# Altium schematic sheet Power Monitor.SchDoc
size A; SheetNumber: 5; SheetTotal: 7
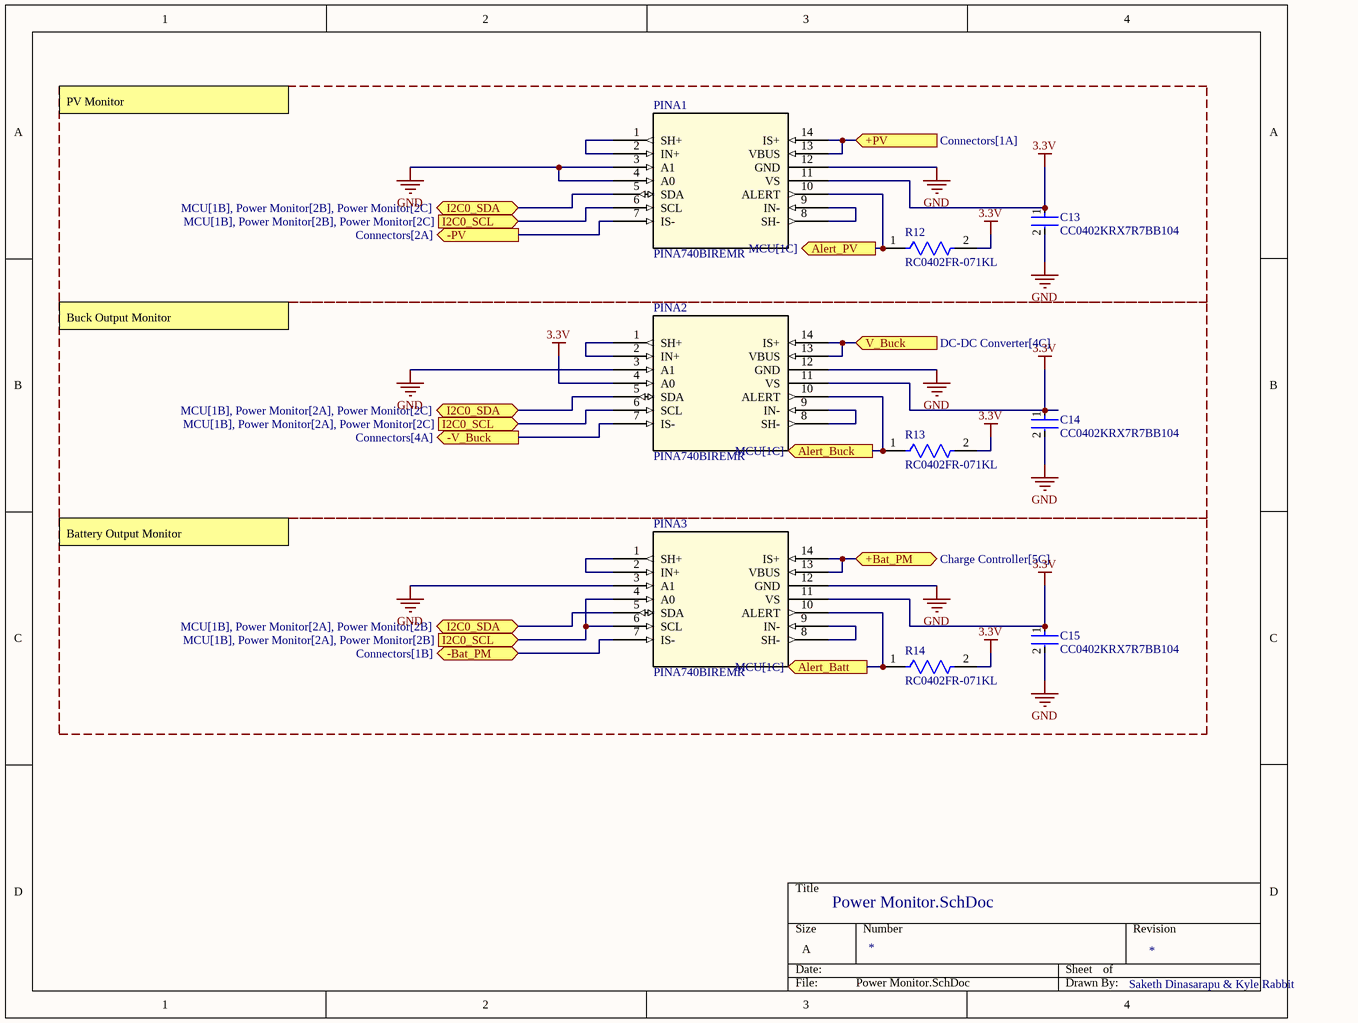
[diagram p0: Power Monitor.SchDoc]

## Parts
C13  CC0402KRX7R7BB104  [FP-CC0402-MFG]
C14  CC0402KRX7R7BB104  [FP-CC0402-MFG]
C15  CC0402KRX7R7BB104  [FP-CC0402-MFG]
PINA1  PINA740BIREMR  [VQFN14_REM_TEX]
PINA2  PINA740BIREMR  [VQFN14_REM_TEX]
PINA3  PINA740BIREMR  [VQFN14_REM_TEX]
R12  RC0402FR-071KL  [FP-RC0402-0_4-IPC_A]
R13  RC0402FR-071KL  [FP-RC0402-0_4-IPC_A]
R14  RC0402FR-071KL  [FP-RC0402-0_4-IPC_A]

## Ports
+Bat_PM (bidir, see Charge Controller[5C]), +PV (in, see Connectors[1A]), -Bat_PM (bidir, see Connectors[1B]), -PV (out, see Connectors[2A]), -V_Buck (out, see Connectors[4A]), Alert_Batt (out, see MCU[1C]), Alert_Buck (out, see MCU[1C]), Alert_PV (out, see MCU[1C]), I2C0_SCL (in, see MCU[1B], Power Monitor[2A], Power Monitor[2B]), I2C0_SCL (in, see MCU[1B], Power Monitor[2A], Power Monitor[2C]), I2C0_SCL (in, see MCU[1B], Power Monitor[2B], Power Monitor[2C]), I2C0_SDA (bidir, see MCU[1B], Power Monitor[2A], Power Monitor[2B]), I2C0_SDA (bidir, see MCU[1B], Power Monitor[2A], Power Monitor[2C]), I2C0_SDA (bidir, see MCU[1B], Power Monitor[2B], Power Monitor[2C]), V_Buck (in, see DC-DC Converter[4C])

## Nets
3.3V: C13.1 C14.1 C15.1 PINA1.11(VS) PINA2.4(A0) PINA2.11(VS) PINA3.11(VS) R12.2 R13.2 R14.2
GND: C13.2 C14.2 C15.2 PINA1.3(A1) PINA1.4(A0) PINA1.12(GND) PINA2.3(A1) PINA2.12(GND) PINA3.3(A1) PINA3.12(GND)
+Bat_PM: PINA3.13(VBUS) PINA3.14(IS+) ; port +Bat_PM
+PV: PINA1.13(VBUS) PINA1.14(IS+) ; port +PV
-Bat_PM: PINA3.7(IS-) ; port -Bat_PM
-PV: PINA1.7(IS-) ; port -PV
-V_Buck: PINA2.7(IS-) ; port -V_Buck
Alert_Batt: PINA3.10(ALERT) R14.1 ; port Alert_Batt
Alert_Buck: PINA2.10(ALERT) R13.1 ; port Alert_Buck
Alert_PV: PINA1.10(ALERT) R12.1 ; port Alert_PV
I2C0_SCL: PINA1.6(SCL) PINA2.6(SCL) PINA3.4(A0) PINA3.6(SCL) ; port I2C0_SCL
I2C0_SDA: PINA1.5(SDA) PINA2.5(SDA) PINA3.5(SDA) ; port I2C0_SDA
V_Buck: PINA2.13(VBUS) PINA2.14(IS+) ; port V_Buck
NetPINA1_1: PINA1.1(SH+) PINA1.2(IN+)
NetPINA1_8: PINA1.8(SH-) PINA1.9(IN-)
NetPINA2_1: PINA2.1(SH+) PINA2.2(IN+)
NetPINA2_8: PINA2.8(SH-) PINA2.9(IN-)
NetPINA3_1: PINA3.1(SH+) PINA3.2(IN+)
NetPINA3_8: PINA3.8(SH-) PINA3.9(IN-)

## Notes on the sheet
- PV Monitor
- Buck Output Monitor
- Battery Output Monitor
- Saketh Dinasarapu & Kyle Rabbit

## Library data of the parts
C13-C15 = CMP-03422-000048-1: CAP CER 0.1UF 16V X7R 0402; Manufacturer: YAGEO; Material: Ceramic; Automotive Grade: NA; Capacitance: 100 nF; Temperature Coefficient: 30ppm/°C; Tolerance: 0.1; Value: 100 nF; Device Class L1: Passive Components; Temperature Range Low: -55°C; Device Class L3: Ceramic Capacitors; Temperature Characteristic: X7R; Ipc Land Pattern Name: CAPC10050X50; Temperature Range High: +125°C; Voltage Rating: 16 V; Temperature: -55°C to +125°C; RoHS: TRUE; Automotive: No; Height: 0.55mm; Device Class L2: Capacitors; Digikey Description: CAP CER 0.1UF 16V X7R 0402; Package: CC0402; Footprint Url: http://www.yageo.com/exep/pages/download/literatures/UPY-C_GEN_24.pdf; ComponentLink2Description: Datasheet; Category: Cap; Lead Free: Yes; Octopart: https://octopart.com/cc0402krx7r7bb104-yageo-42244624; ComponentLink2URL: http://www.yageo.com/documents/recent/UPY-GP_NP0_16V-to-50V_16.pdf; Manufacturer Part Number: CC0402KRX7R7BB104; Mouser Description: 0402 0.1 uF 16 V ±10 % Tolerance X7R SMT Multilayer Ceramic Capacitor
PINA1-PINA3 = PINA740BIREMR: No Description Available; Mfr_Name: Texas Instruments; Type: Linear; RefDes: RefDes
R12-R14 = CMP-2002-07472-3: RES 1K OHM 1% 1/16W 0402; Max Power Dissipation: 63mW; Resistance: 1kR; Voltage Rating (DC): 50V; Temperature Coefficient: 100ppm/°C; Power Rating: 62.5mW; Technology: THICK FILM; Size Code: 0402; Series: RC; Length: 1mm; Case/Package: 0402; Features: Moisture Resistant; Termination: SMD/SMT; Case Code (Metric): 1005; Reach SVHC Compliant: Yes; Number of Terminations: 2; Tolerance: 1%; Lead Free: Lead Free; Military Standard: Not; Resistor Type: Thick Film; Max Operating Temperature: 155°C; RoHS Compliant: Yes; Construction: Rectangular; Voltage Rating: 50V; Packaging: Tape and Reel; Height: 0.32mm; Number of Pins: 2; Resistance Tolerance: 1%; Case Code (Imperial): 0402; Depth: 0.5mm; Min Operating Temperature: -55°C; Width: 0.5mm